# EAGLE schematic GP-IVL2-mod (EAGLE 6.3)
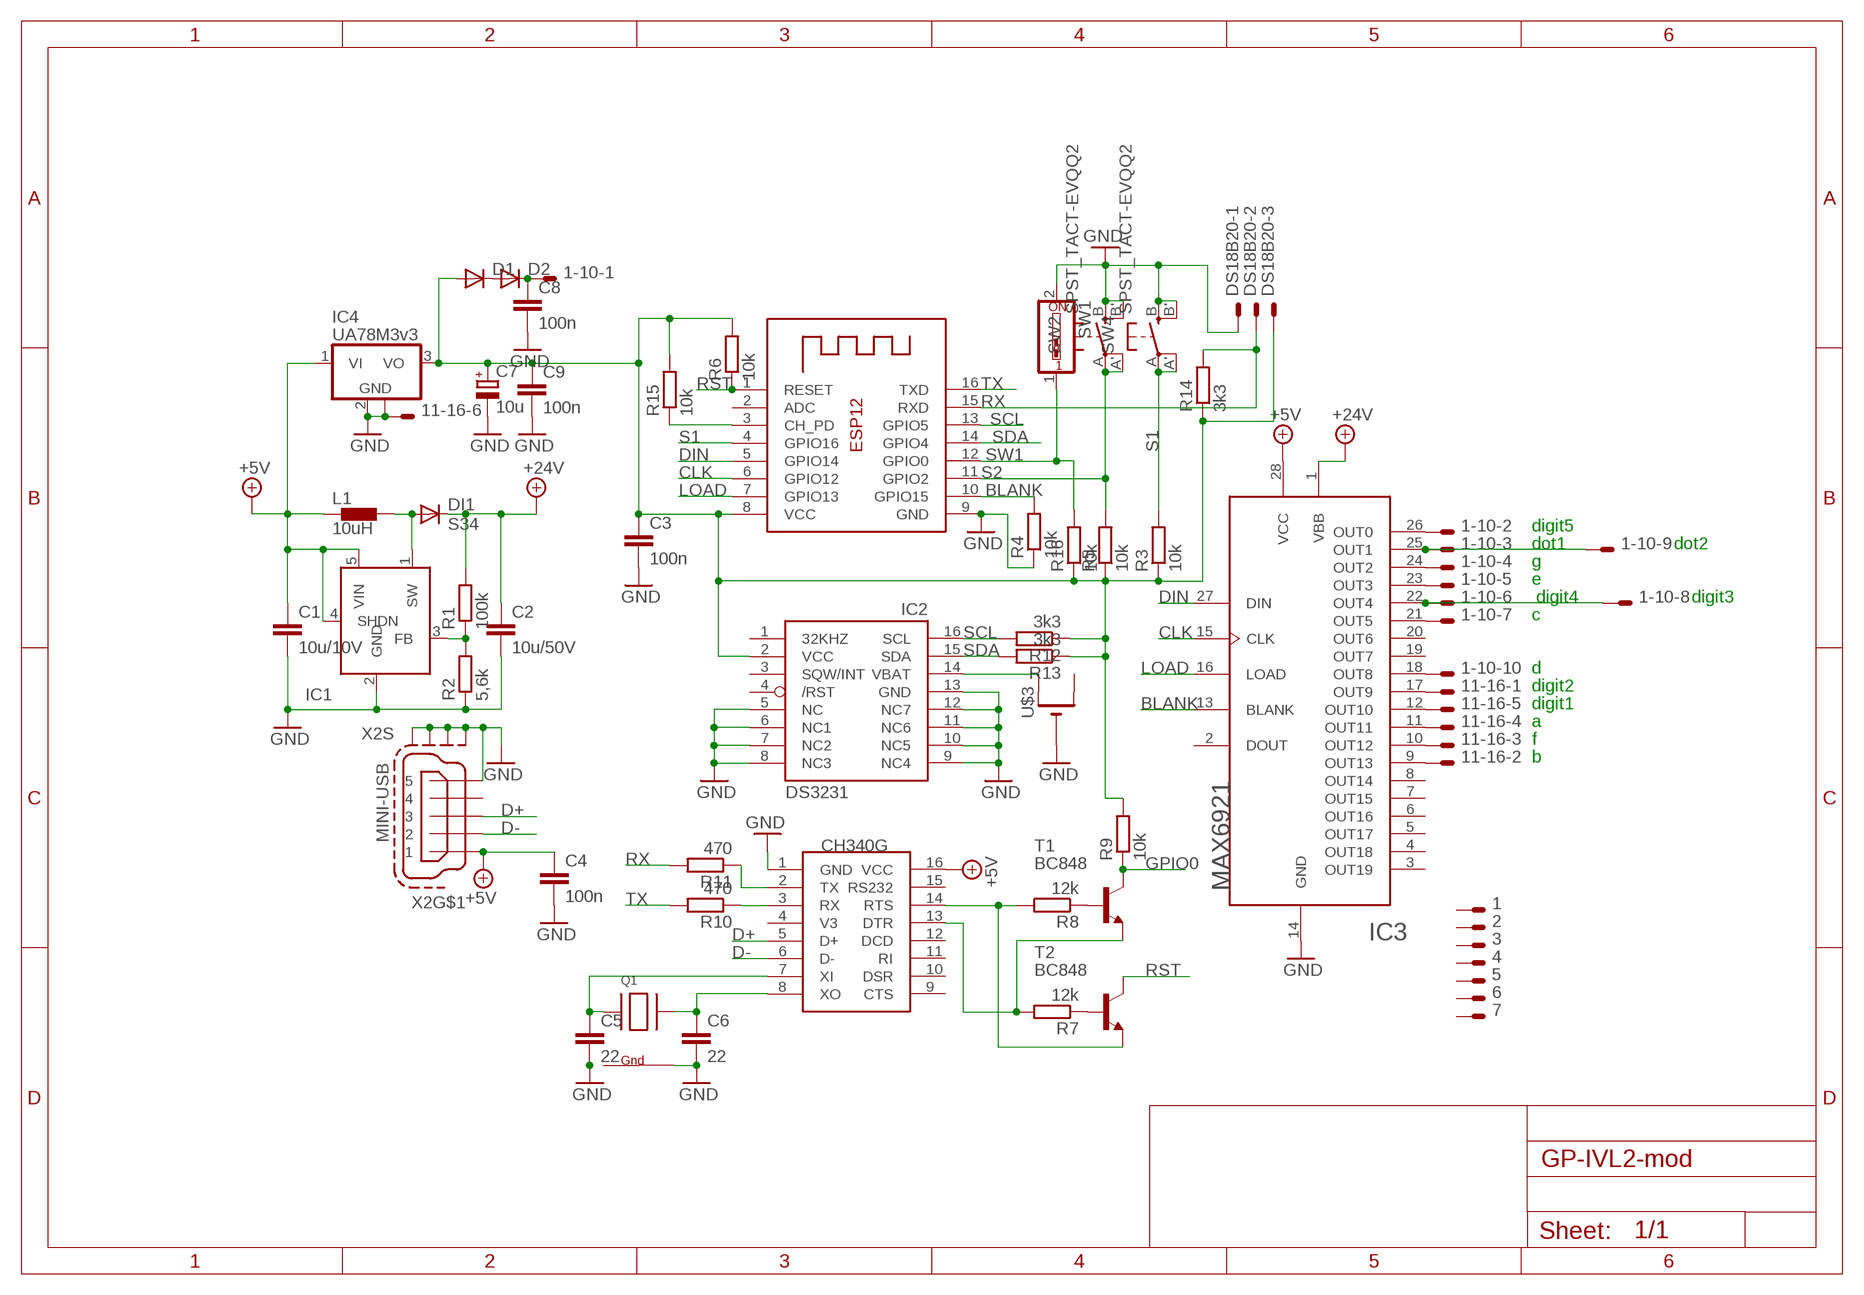
[diagram p0: schematic, sheet 1]

## Parts
1  1  PAD1  [PAD1]
1-10  1-10  PAD10  [PAD10]
2  2  PAD1  [PAD1]
3  3  PAD1  [PAD1]
4  4  PAD1  [PAD1]
5  5  PAD1  [PAD1]
6  6  PAD1  [PAD1]
7  7  PAD1  [PAD1]
11-16  11-16  PAD6  [PAD6]
C1  10u/10V  C1206  [1206]
C2  10u/50V  C1206  [1206]
C3  100n  C-EUC0603  [C0603]
C4  100n  C-EUC0603  [C0603]
C5  22  C-EUC0603  [C0603]
C6  22  C-EUC0603  [C0603]
C7  10u  CPOL-EUE1.8-4  [E1,8-4]
C8  100n  C-EUC0603  [C0603]
C9  100n  C-EUC0603  [C0603]
D1  DIODE-D-7.5  [D-7.5]
D2  DIODE-D-7.5  [D-7.5]
DI1  S34  DDI214  [DI-214]
DS18B20  PAD3  [PAD3]
IC1  LT1930  [SOT23-5]
IC2  DS3231/SO  [SO16W]
IC3  MAX6921  MAX6921SOIC28W  [SO-28W]
IC4  UA78M3v3  UA78M05DCY  [SOT223]
L1  10uH  LDR73A  [DR73A]
Q1  XTAL-4-3225  [NX3225]
R1  100k  R0603  [0603]
R2  5,6k  R0603  [0603]
R3  10k  R-EU_R0603  [R0603]
R4  10k  R-EU_R0603  [R0603]
R5  10k  R-EU_R0603  [R0603]
R6  10k  R-EU_R0603  [R0603]
R7  12k  R-EU_R0603  [R0603]
R8  12k  R-EU_R0603  [R0603]
R9  10k  R-EU_R0603  [R0603]
R10  470  R-EU_R0603  [R0603]
R11  470  R-EU_R0603  [R0603]
R12  3k3  R-EU_R0603  [R0603]
R13  3k3  R-EU_R0603  [R0603]
R14  3k3  R-EU_MELF0102W  [MINI_MELF-0102W]
R15  10k  R-EU_R0603  [R0603]
R16  10k  R-EU_R0603  [R0603]
SW1  SW_DIP-1  [EDG-01]
SW2  SPST_TACT-EVQQ2  [EVQ-Q2]
SW4  SPST_TACT-EVQQ2  [EVQ-Q2]
T1  BC848  [SOT23]
T2  BC848  [SOT23]
U$1  CH340G  [SOIC16]
U$3  CR1220SMT  [CR1220-SMD]
X1  ESP-12  [ESP-12]
X2  MINI-USB  MINI-USB-SCHIELD-32005-201  [32005-201]

## Nets
+5V: C1.1 C4.1 IC1.4(SHDN) IC1.5(VIN) IC3.28(VCC) IC4.1(VI) L1.1 U$1.16(VCC) X2.1
BLANK: IC3.13(BLANK) R4.2 X1.10(GPIO15)
CLK: IC3.15(CLK) X1.6(GPIO12)
D+: U$1.5(D+) X2.3
D-: U$1.6(D-) X2.2
DIN: IC3.27(DIN) X1.5(GPIO14)
GND: 11-16.P$6 C1.2 C2.2 C3.2 C4.2 C5.2 C6.2 C7.- C8.2 C9.2 DS18B20.P$1 IC1.2(GND) IC2.5(NC) IC2.6(NC1) IC2.7(NC2) IC2.8(NC3) IC2.9(NC4) IC2.10(NC5) IC2.11(NC6) IC2.12(NC7) IC2.13(GND) IC3.14(GND) IC4.2(GND) IC4.4(GND) Q1.2(G2) R2.1 R4.1 SW1.2 SW2.B'(S1) SW2.B(S) SW4.B'(S1) SW4.B(S) U$1.1(GND) U$3.- X1.9(GND) X2.5 X2.M1(S:S1) X2.M2(S:S2) X2.M3(S:S3) X2.M4(S:S4)
GPIO0: R9.1 T1.3(C)
LOAD: IC3.16(LOAD) X1.7(GPIO13)
N$1: IC1.3(FB) R1.1 R2.2
N$2: DI1.A IC1.1(SW) L1.2
N$3: C5.1 Q1.1(X1) U$1.7(XI)
N$4: R15.1 X1.3(CH_PD)
N$5: IC2.14(VBAT) U$3.+$1(+)
N$8: R10.1 U$1.3(RX)
N$9: R7.1 T2.1(B)
N$10: R8.1 T1.1(B)
N$11: R8.2 T2.2(E) U$1.14(RTS)
N$12: R7.2 T1.2(E) U$1.13(DTR)
N$13: R11.1 U$1.2(TX)
N$14: C6.1 Q1.3(X2) U$1.8(XO)
N$15: D1.C D2.A
N$16: 1-10.P$1 C8.1 D2.C
N$19: 1-10.P$2 IC3.26(OUT0)
N$20: 1-10.P$3 1-10.P$9 IC3.25(OUT1)
N$23: 1-10.P$4 IC3.24(OUT2)
N$24: 1-10.P$5 IC3.23(OUT3)
N$30: C3.1 C7.+ C9.1 D1.A DS18B20.P$3 IC2.2(VCC) IC4.3(VO) R3.1 R5.1 R6.2 R9.2 R12.1 R13.1 R14.1 R15.2 R16.1 X1.8(VCC)
N$31: 1-10.P$6 1-10.P$8 IC3.22(OUT4)
N$32: 1-10.P$7 IC3.21(OUT5)
N$35: 1-10.P$10 IC3.18(OUT8)
N$36: 11-16.P$1 IC3.17(OUT9)
N$37: 11-16.P$5 IC3.12(OUT10)
N$38: 11-16.P$4 IC3.11(OUT11)
N$39: 11-16.P$3 IC3.10(OUT12)
N$40: 11-16.P$2 IC3.9(OUT13)
RST: R6.1 T2.3(C) X1.1(RESET)
RX: DS18B20.P$2 R11.2 R14.2 X1.15(RXD)
S1: R3.2 SW4.A'(P1) SW4.A(P) X1.4(GPIO16)
S2: R5.2 SW2.A'(P1) SW2.A(P) X1.11(GPIO2)
SCL: IC2.16(SCL) R12.2 X1.14(GPIO4)
SDA: IC2.15(SDA) R13.2 X1.13(GPIO5)
SW1: R16.2 SW1.1 X1.12(GPIO0)
TX: R10.2 X1.16(TXD)
VBB: C2.1 DI1.K(C) IC3.1(VBB) R1.2 ; supply symbol labelled +24V
Unconnected: 1.1(S) 2.1(S) 3.1(S) 4.1(S) 5.1(S) 6.1(S) 7.1(S) IC2.1(32KHZ) IC2.3(SQW/INT) IC2.4(/RST) IC3.2(DOUT) IC3.3(OUT19) IC3.4(OUT18) IC3.5(OUT17) IC3.6(OUT16) IC3.7(OUT15) IC3.8(OUT14) IC3.19(OUT7) IC3.20(OUT6) U$1.4(V3) U$1.9(CTS) U$1.10(DSR) U$1.11(RI) U$1.12(DCD) U$1.15(RS232) U$3.+$2(+1) X1.2(ADC) X2.4

## Notes on the sheet
- digit5
- dot1 | dot2
- g
- e
- digit4 | digit3
- c
- d
- digit2
- digit1
- a
- f
- b

## Power pins joined to a net without a drawn wire
G1: Q1.4(G1)

## Library data of the parts
1-7 = tuskesor:PAD1
1-10 = tuskesor:PAD10
11-16 = tuskesor:PAD6
C1 C2 =  Zozo:C
C3-C6 C8 C9 = resistor:C-EU: CAPACITOR, European symbol
C7 = resistor:CPOL-EU: POLARIZED CAPACITOR, European symbol
D1 D2 = diode:DIODE-: DIODE
DI1 =  Zozo:D
DS18B20 = tuskesor:PAD3
IC1 =  Zozo:LT1930
IC2 = adafruit:DS3231
IC3 = JVN:MAX6921
IC4 = linear:UA78M*: POSITIVE-VOLTAGE REGULATORS Source: http://focus.ti.com/lit/ds/symlink/ua78m33.pdf
L1 =  Zozo:L
Q1 = adafruit:XTAL-4: Classic 4-pin 3.2 x 2.5mm crystal
R1 R2 =  Zozo:R
R3-R16 = resistor:R-EU_: RESISTOR, European symbol
SW1 = special:SW_DIP-1: DIP SWITCH
SW2 SW4 = adafruit:SPST_TACT: SMT 6mm switch, EVQQ2 series http://www.ladyada.net/library/eagle
T1 T2 = transistor:BC848: NPN TRANSISTOR
U$1 = ch340g:CH340G
U$3 = adafruit1:CR1220: CR1216/CR1220/CR1225 12mm 3V lithium coin cell Great for battery packup. Both SMT and THM holders. Note the THM package has the ground pads on both sides of the PCB so that the masks are the same - this reduces the cost
X1 = adafruit:ESP-12
X2 = con-cypressindustries:MINI-USB-SCHIELD-: MINI USB-B Conector Source: www.cypressindustries.com; OC_FARNELL: unknown; OC_NEWARK: unknown

## Net classes
1 Power: width 0.305 mm